# EasyEDA Pro project PCB.eprj, schematic Program_Counter
Board Name: Program_Counter; Create Date: 2025-08-09; Page Name: P1; Project Name: PCB; Schematic Name: Program_Counter; Update Date: 2025-08-12; Company: EasyEDA.com; Page Size: A4; Version: V1.0
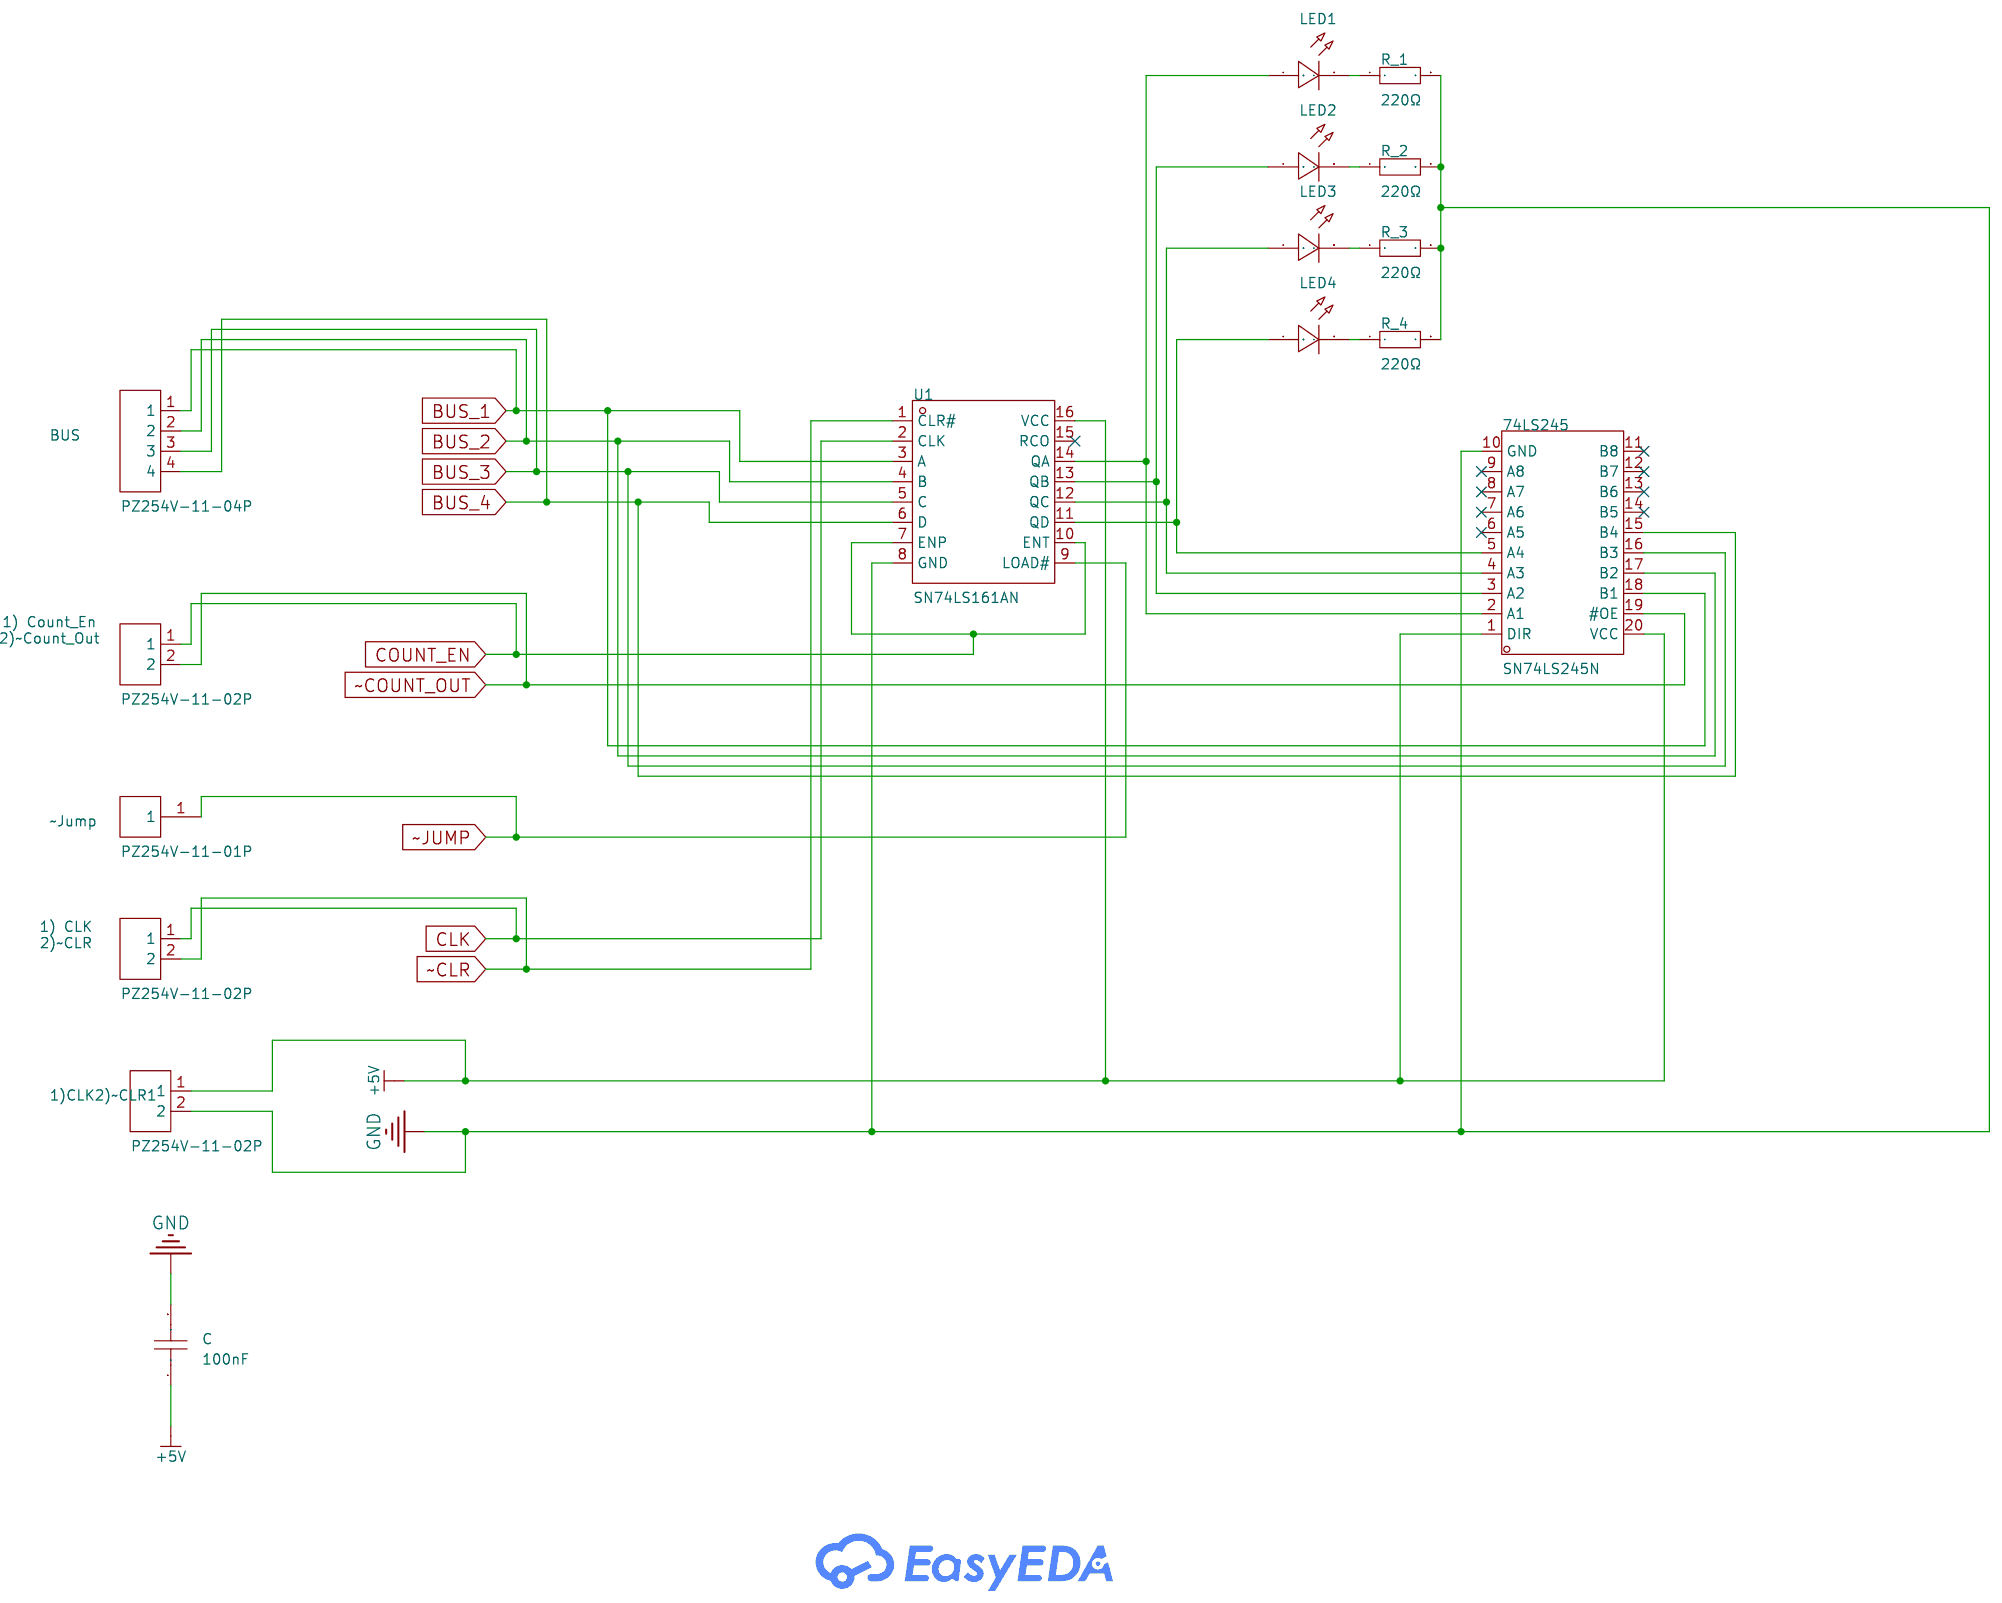
[diagram p4: schematic sheet]

## Parts
1) CLK
2)~CLR  PZ254V-11-02P  [HDR-TH_2P-P2.54-V-M]
1) Count_En
2)~Count_Out  PZ254V-11-02P  [HDR-TH_2P-P2.54-V-M]
1)CLK2)~CLR1  PZ254V-11-02P  [HDR-TH_2P-P2.54-V-M]
74LS245  SN74LS245N  [DIP-20_L25.5-W10.0-P2.54-LS7.6-BL]
BUS  PZ254V-11-04P  [HDR-TH_4P-P2.54-V-M]
C  100nF  [CAP-TH_L8.5-W5.0-P5.00-D1.2]
LED1  -  [LED-TH_BD5.8-P2.54-FD]
LED2  -  [LED-TH_BD5.8-P2.54-FD]
LED3  -  [LED-TH_BD5.8-P2.54-FD]
LED4  -  [LED-TH_BD5.8-P2.54-FD]
R_1  220Ω  [R_AXIAL-0.4]
R_2  220Ω  [R_AXIAL-0.4]
R_3  220Ω  [R_AXIAL-0.4]
R_4  220Ω  [R_AXIAL-0.4]
U1  SN74LS161AN  [PDIP-16_L19.3-W6.4-P2.54-LS7.9-BL]
~Jump  PZ254V-11-01P  [HDR-TH_1P-P2.54-V-M]

## Library data of the parts
1) CLK
2)~CLR 1) Count_En
2)~Count_Out 1)CLK2)~CLR1 = PZ254V-11-02P: LCSC Part Name: 1x2P 间距:2.54mm 方针 直插; Supplier Part: C492401; Manufacturer: XFCN(兴飞); Supplier Footprint: 插件,P=2.54mm; JLCPCB Part Class: Extended Part; Datasheet: https://atta.szlcsc.com/upload/public/pdf/source/20200309/C492401_A812433581A9B211A7FFA413ADDFF0E5.pdf; Supplier: LCSC; Pin Structure: 1x2P; Pitch: 2.54mm; Circluar Pins/Square Pins: Policy; Mounting Type: Straight; Number of Rows: Single Row; Number of Pins: 2P; Length of Mating Pin: 6mm; Insulation Height: 2.5mm; Length of End Connection Pin: 3mm; Contact Material: Brass; Operating Temperature: -40℃~+105℃; Color: Black
74LS245 = SN74LS245N: output type:Tri-State Voltage - Supply:4.75V~5.25V Voltage - Supply:4.75V~5.25V Number of Elements:1 Number of Bits per Element:8 Current - Output Low(IOL):24mA Current - Output High(IOH):15mA Logic Family:74LS Operating Temperature:0℃~+70℃ Operating Temp; Supplier Part: C352966; Manufacturer: TI(德州仪器); Supplier Footprint: DIP-20; JLCPCB Part Class: Extended Part; Datasheet: https://www.ti.com/cn/lit/gpn/sn74ls245; Supplier: LCSC; output type: Tri-State; Voltage - Supply: 4.75V~5.25V; Number of Elements: 1; Number of Bits per Element: 8; Current - Output Low(IOL): 24mA; Current - Output High(IOH): 15mA; Logic Family: 74LS; Operating Temperature: 0℃~+70℃
BUS = PZ254V-11-04P_C492403: LCSC Part Name: 1x4P 间距:2.54mm 方针 直插; Supplier Part: C492403; Manufacturer: XFCN(兴飞); Supplier Footprint: 插件,P=2.54mm; JLCPCB Part Class: Extended Part; Datasheet: https://atta.szlcsc.com/upload/public/pdf/source/20200309/C492403_F9F19131791D08044AD4F84F8E751A34.pdf; Supplier: LCSC; Pin Structure: 1x4P; Pitch: 2.54mm; Circluar Pins/Square Pins: Policy; Mounting Type: Straight; Number of Rows: Single Row; Number of Pins: 4P; Length of Mating Pin: 6mm; Insulation Height: 2.5mm; Length of End Connection Pin: 3mm; Contact Material: Brass; Operating Temperature: -40℃~+105℃; Color: Black
C = CT4-0805B104K500F3: LCSC Part Name: 100nF ±10% 50V C3型（直脚）; Supplier Part: C84772; Manufacturer: FH(风华); Supplier Footprint: 插件,P=5.08mm; JLCPCB Part Class: Extended Part; Datasheet: https://atta.szlcsc.com/upload/public/pdf/source/20190402/C385200_059806A6312B28FF1421A2413EB641E1.pdf; Supplier: LCSC; Tolerance: ±10%
LED1-LED4 = LED_TH-R_5mm: Supplier Footprint: Through
R_1-R_4 = Res_AXIAL-1/4W: Supplier Footprint: Through
U1 = SN74LS161AN: LCSC Part Name: 25MHz 4位二进制计数器; Supplier Part: C1547960; Manufacturer: TI(德州仪器); Supplier Footprint: PDIP-16; JLCPCB Part Class: Extended Part; Datasheet: https://www.ti.com/cn/lit/gpn/sn74ls161a; Supplier: LCSC; Logic Type: Binary Counter; Direction: 向上计数器; Supply Voltage: 4.75V~5.25V; Number of Elements: 1; Number of Bits per Element: 4; Trigger Type: Positive Edge; Reset Style: 异步; Timing mode: Synchronous; Count Rate: 25MHz; Operating Temperature: 0℃~+70℃
~Jump = PZ254V-11-01P: LCSC Part Name: 1x1P 间距:2.54mm 方针 直插; Supplier Part: C492400; Manufacturer: XFCN(兴飞); Supplier Footprint: 插件,P=2.54mm; JLCPCB Part Class: Extended Part; Datasheet: https://atta.szlcsc.com/upload/public/pdf/source/20200309/C492400_46876A5B545F5AE6B8D4A09C46E276E8.pdf; Supplier: LCSC; Pin Structure: 1x1P; Pitch: 2.54mm; Circluar Pins/Square Pins: Policy; Mounting Type: Straight; Number of Rows: Single Row; Number of Pins: 1P; Length of Mating Pin: 6mm; Insulation Height: 2.5mm; Length of End Connection Pin: 3mm; Contact Material: Brass; Operating Temperature: -40℃~+105℃; Color: Black

## Nets
+5V: 1)CLK2)~CLR1.1 74LS245.1(DIR) 74LS245.20(VCC) C.1 U1.16(VCC)
GND: 1)CLK2)~CLR1.2 74LS245.10(GND) C.2 R_1.2 R_2.2 R_3.2 R_4.2 U1.8(GND)
BUS_1: 74LS245.18(B1) BUS.1 U1.3(A)
BUS_2: 74LS245.17(B2) BUS.2 U1.4(B)
BUS_3: 74LS245.16(B3) BUS.3 U1.5(C)
BUS_4: 74LS245.15(B4) BUS.4 U1.6(D)
CLK: 1) CLK
2)~CLR.1 U1.2(CLK)
COUNT_EN: 1) Count_En
2)~Count_Out.1 U1.7(ENP) U1.10(ENT)
~CLR: 1) CLK
2)~CLR.2 U1.1(CLR#)
~COUNT_OUT: 1) Count_En
2)~Count_Out.2 74LS245.19(#OE)
~JUMP: U1.9(LOAD#) ~Jump.1
$1N1140: 74LS245.2(A1) LED1.1(C) U1.14(QA)
$1N1146: 74LS245.3(A2) LED2.1(C) U1.13(QB)
$1N1152: 74LS245.4(A3) LED3.1(C) U1.12(QC)
$1N1159: 74LS245.5(A4) LED4.1(C) U1.11(QD)
$1N1651: LED1.2(A) R_1.1
$1N1749: LED2.2(A) R_2.1
$1N1845: LED4.2(A) R_4.1
$1N1847: LED3.2(A) R_3.1

Not connected (* = marked no-connect by the designer): 74LS245 6(A5)* 7(A6)* 8(A7)* 9(A8)* 11(B8)* 12(B7)* 13(B6)* 14(B5)*; U1 15(RCO)*
